# EAGLE schematic actuator_control_1.2.0 (EAGLE 8.1.1)
DESCRIPTION: microOBD 200 OBD-II Module; HW_REV: 1.4; PCB_REV: C; PCB_SPEC1: Layer Count: 4; PCB_SPEC2: Size: 1.3" x 0.59"; PCB_SPEC3: Finish Thickness: 0.049" - 0.052"; PCB_SPEC4: Copper Weight: 1oz; TITLE: STM1120

## Sheet 1 of 6: Solenoid Bank 1
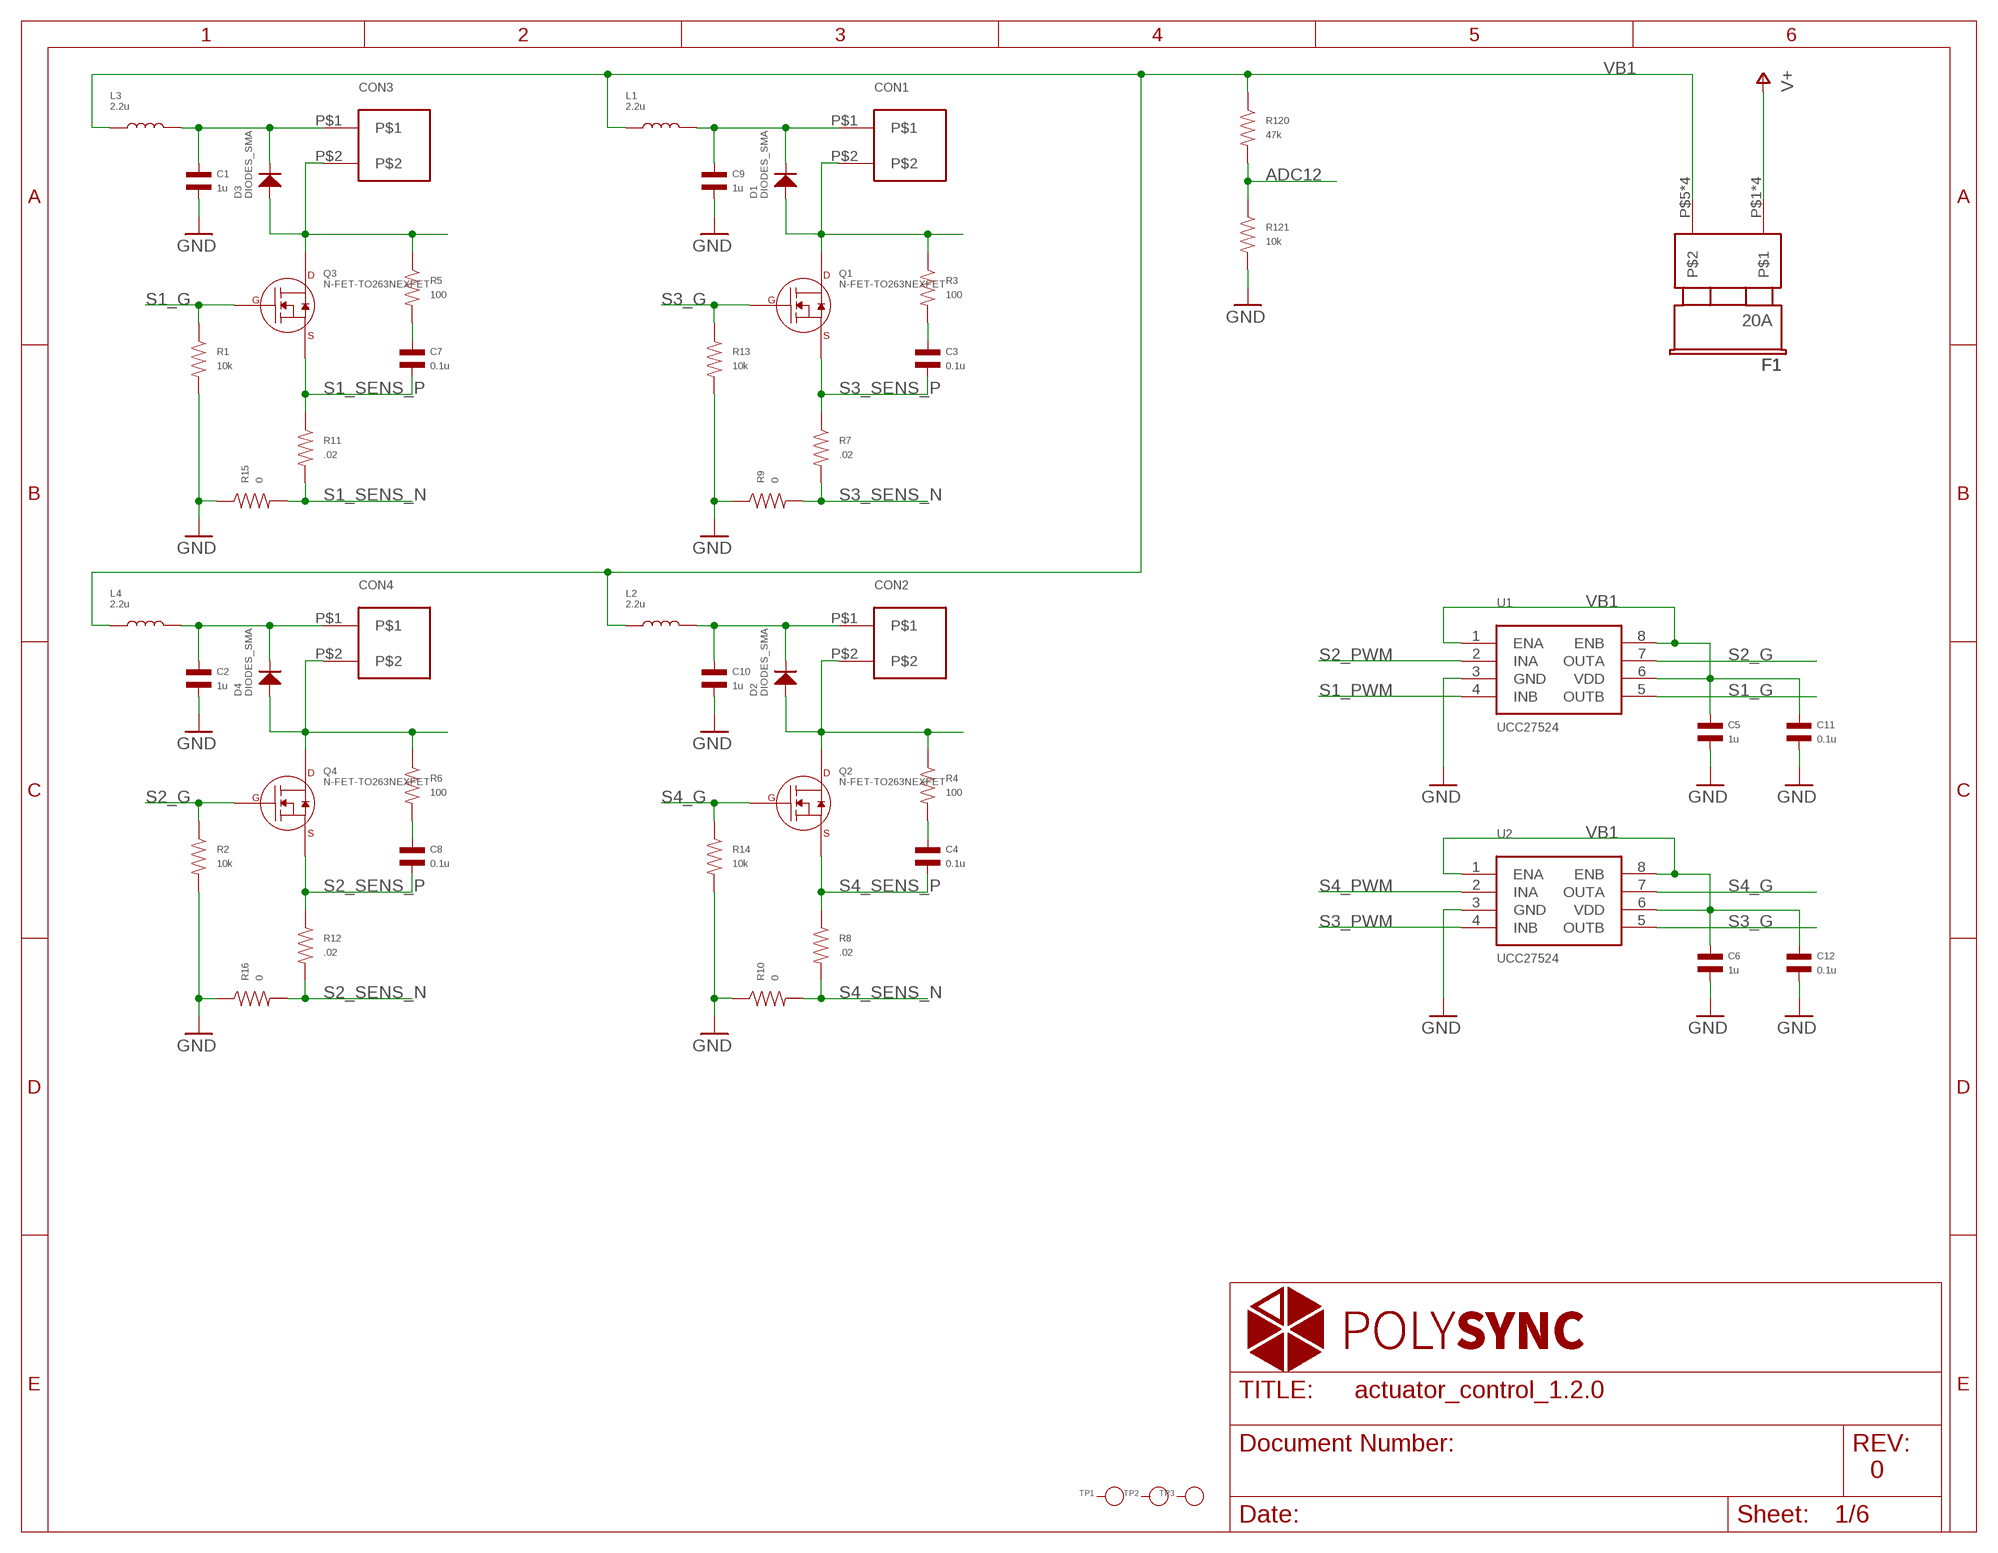
[diagram p0: schematic, sheet 1]

### Parts
C1  1u  CAPACITOR_NP_1206  [C1206]
C2  1u  CAPACITOR_NP_1206  [C1206]
C3  0.1u  CAPACITOR_NP_0805  [C0805]
C4  0.1u  CAPACITOR_NP_0805  [C0805]
C5  1u  CAPACITOR_NP_1206  [C1206]
C6  1u  CAPACITOR_NP_1206  [C1206]
C7  0.1u  CAPACITOR_NP_0805  [C0805]
C8  0.1u  CAPACITOR_NP_0805  [C0805]
C9  1u  CAPACITOR_NP_1206  [C1206]
C10  1u  CAPACITOR_NP_1206  [C1206]
C11  0.1u  CAPACITOR_NP_0805  [C0805]
C12  0.1u  CAPACITOR_NP_0805  [C0805]
CON1  CON23.5MM  [PHOENIX_2_45]
CON2  CON23.5MM  [PHOENIX_2_45]
CON3  CON23.5MM  [PHOENIX_2_45]
CON4  CON23.5MM  [PHOENIX_2_45]
D1  DIODES_SMA  [SMA]
D2  DIODES_SMA  [SMA]
D3  DIODES_SMA  [SMA]
D4  DIODES_SMA  [SMA]
F1  20A  FUSE  [FUSE_ATO]
L1  2.2u  INDUCTORSRP7050  [SRP7050]
L2  2.2u  INDUCTORSRP7050  [SRP7050]
L3  2.2u  INDUCTORSRP7050  [SRP7050]
L4  2.2u  INDUCTORSRP7050  [SRP7050]
Q1  N-FET-TO263NEXFET  [SON8-DQJ]
Q2  N-FET-TO263NEXFET  [SON8-DQJ]
Q3  N-FET-TO263NEXFET  [SON8-DQJ]
Q4  N-FET-TO263NEXFET  [SON8-DQJ]
R1  10k  RESISTOR_0402  [R0402]
R2  10k  RESISTOR_0402  [R0402]
R3  100  RESISTOR_0805  [R0805]
R4  100  RESISTOR_0805  [R0805]
R5  100  RESISTOR_0805  [R0805]
R6  100  RESISTOR_0805  [R0805]
R7  .02  RESISTOR_1206  [R1206]
R8  .02  RESISTOR_1206  [R1206]
R9  0  RESISTOR_0805  [R0805]
R10  0  RESISTOR_0805  [R0805]
R11  .02  RESISTOR_1206  [R1206]
R12  .02  RESISTOR_1206  [R1206]
R13  10k  RESISTOR_0402  [R0402]
R14  10k  RESISTOR_0402  [R0402]
R15  0  RESISTOR_0805  [R0805]
R16  0  RESISTOR_0805  [R0805]
R120  47k  RESISTOR_0402  [R0402]
R121  10k  RESISTOR_0402  [R0402]
TP1  PAD-TEST-POINT'4545'  [TP_4545]
TP2  PAD-TEST-POINT'4545'  [TP_4545]
TP3  PAD-TEST-POINT'4545'  [TP_4545]
U1  UCC27524  [SOIC-8]
U2  UCC27524  [SOIC-8]

### Nets
ADC12: R120.P$2 R121.P$1 ; also sheet 5
GND: C1.P$2 C2.P$2 C5.P$2 C6.P$2 C9.P$2 C10.P$2 C11.P$2 C12.P$2 R1.P$2 R2.P$2 R9.P$1 R10.P$1 R13.P$2 R14.P$2 R15.P$1 R16.P$1 R121.P$2 U1.3(GND) U2.3(GND) ; also sheet 2,3,4,5,6
N$1: C1.P$1 CON3.P$1 D3.CATHODE L3.P$2
N$5: CON3.P$2 D3.ANODE Q3.P$5(DRAIN) Q3.P$6(DRAIN) Q3.P$7(DRAIN) Q3.P$8(DRAIN) Q3.P$9(DRAIN) R5.P$1
N$6: C7.P$1 R5.P$2
N$9: C2.P$1 CON4.P$1 D4.CATHODE L4.P$2
N$10: CON4.P$2 D4.ANODE Q4.P$5(DRAIN) Q4.P$6(DRAIN) Q4.P$7(DRAIN) Q4.P$8(DRAIN) Q4.P$9(DRAIN) R6.P$1
N$11: C8.P$1 R6.P$2
N$13: C9.P$1 CON1.P$1 D1.CATHODE L1.P$2
N$14: CON1.P$2 D1.ANODE Q1.P$5(DRAIN) Q1.P$6(DRAIN) Q1.P$7(DRAIN) Q1.P$8(DRAIN) Q1.P$9(DRAIN) R3.P$1
N$15: C3.P$1 R3.P$2
N$17: C10.P$1 CON2.P$1 D2.CATHODE L2.P$2
N$18: CON2.P$2 D2.ANODE Q2.P$5(DRAIN) Q2.P$6(DRAIN) Q2.P$7(DRAIN) Q2.P$8(DRAIN) Q2.P$9(DRAIN) R4.P$1
N$19: C4.P$1 R4.P$2
S1_G: Q3.P$4(GATE) R1.P$1 U1.5(OUTB)
S1_PWM: U1.4(INB) ; also sheet 5
S1_SENS_N: R11.P$2 R15.P$2 ; also sheet 3
S1_SENS_P: C7.P$2 Q3.P$1(SOURCE) Q3.P$2(SOURCE) Q3.P$3(SOURCE) R11.P$1 ; also sheet 3
S2_G: Q4.P$4(GATE) R2.P$1 U1.7(OUTA)
S2_PWM: U1.2(INA) ; also sheet 5
S2_SENS_N: R12.P$2 R16.P$2 ; also sheet 3
S2_SENS_P: C8.P$2 Q4.P$1(SOURCE) Q4.P$2(SOURCE) Q4.P$3(SOURCE) R12.P$1 ; also sheet 3
S3_G: Q1.P$4(GATE) R13.P$1 U2.5(OUTB)
S3_PWM: U2.4(INB) ; also sheet 5
S3_SENS_N: R7.P$2 R9.P$2 ; also sheet 3
S3_SENS_P: C3.P$2 Q1.P$1(SOURCE) Q1.P$2(SOURCE) Q1.P$3(SOURCE) R7.P$1 ; also sheet 3
S4_G: Q2.P$4(GATE) R14.P$1 U2.7(OUTA)
S4_PWM: U2.2(INA) ; also sheet 5
S4_SENS_N: R8.P$2 R10.P$2 ; also sheet 3
S4_SENS_P: C4.P$2 Q2.P$1(SOURCE) Q2.P$2(SOURCE) Q2.P$3(SOURCE) R8.P$1 ; also sheet 3
V+: F1.P$1 F1.P$2 F1.P$3 F1.P$4 ; also sheet 5,6
VB1: C5.P$1 C6.P$1 C11.P$1 C12.P$1 F1.P$5 F1.P$6 F1.P$7 F1.P$8 L1.P$1 L2.P$1 L3.P$1 L4.P$1 R120.P$1 U1.1(ENA) U1.6(VDD) U1.8(ENB) U2.1(ENA) U2.6(VDD) U2.8(ENB) ; also sheet 2
Unconnected: TP1.T TP2.T TP3.T

### Notes on the sheet
- 0

## Sheet 2 of 6: Solenoid Bank 2
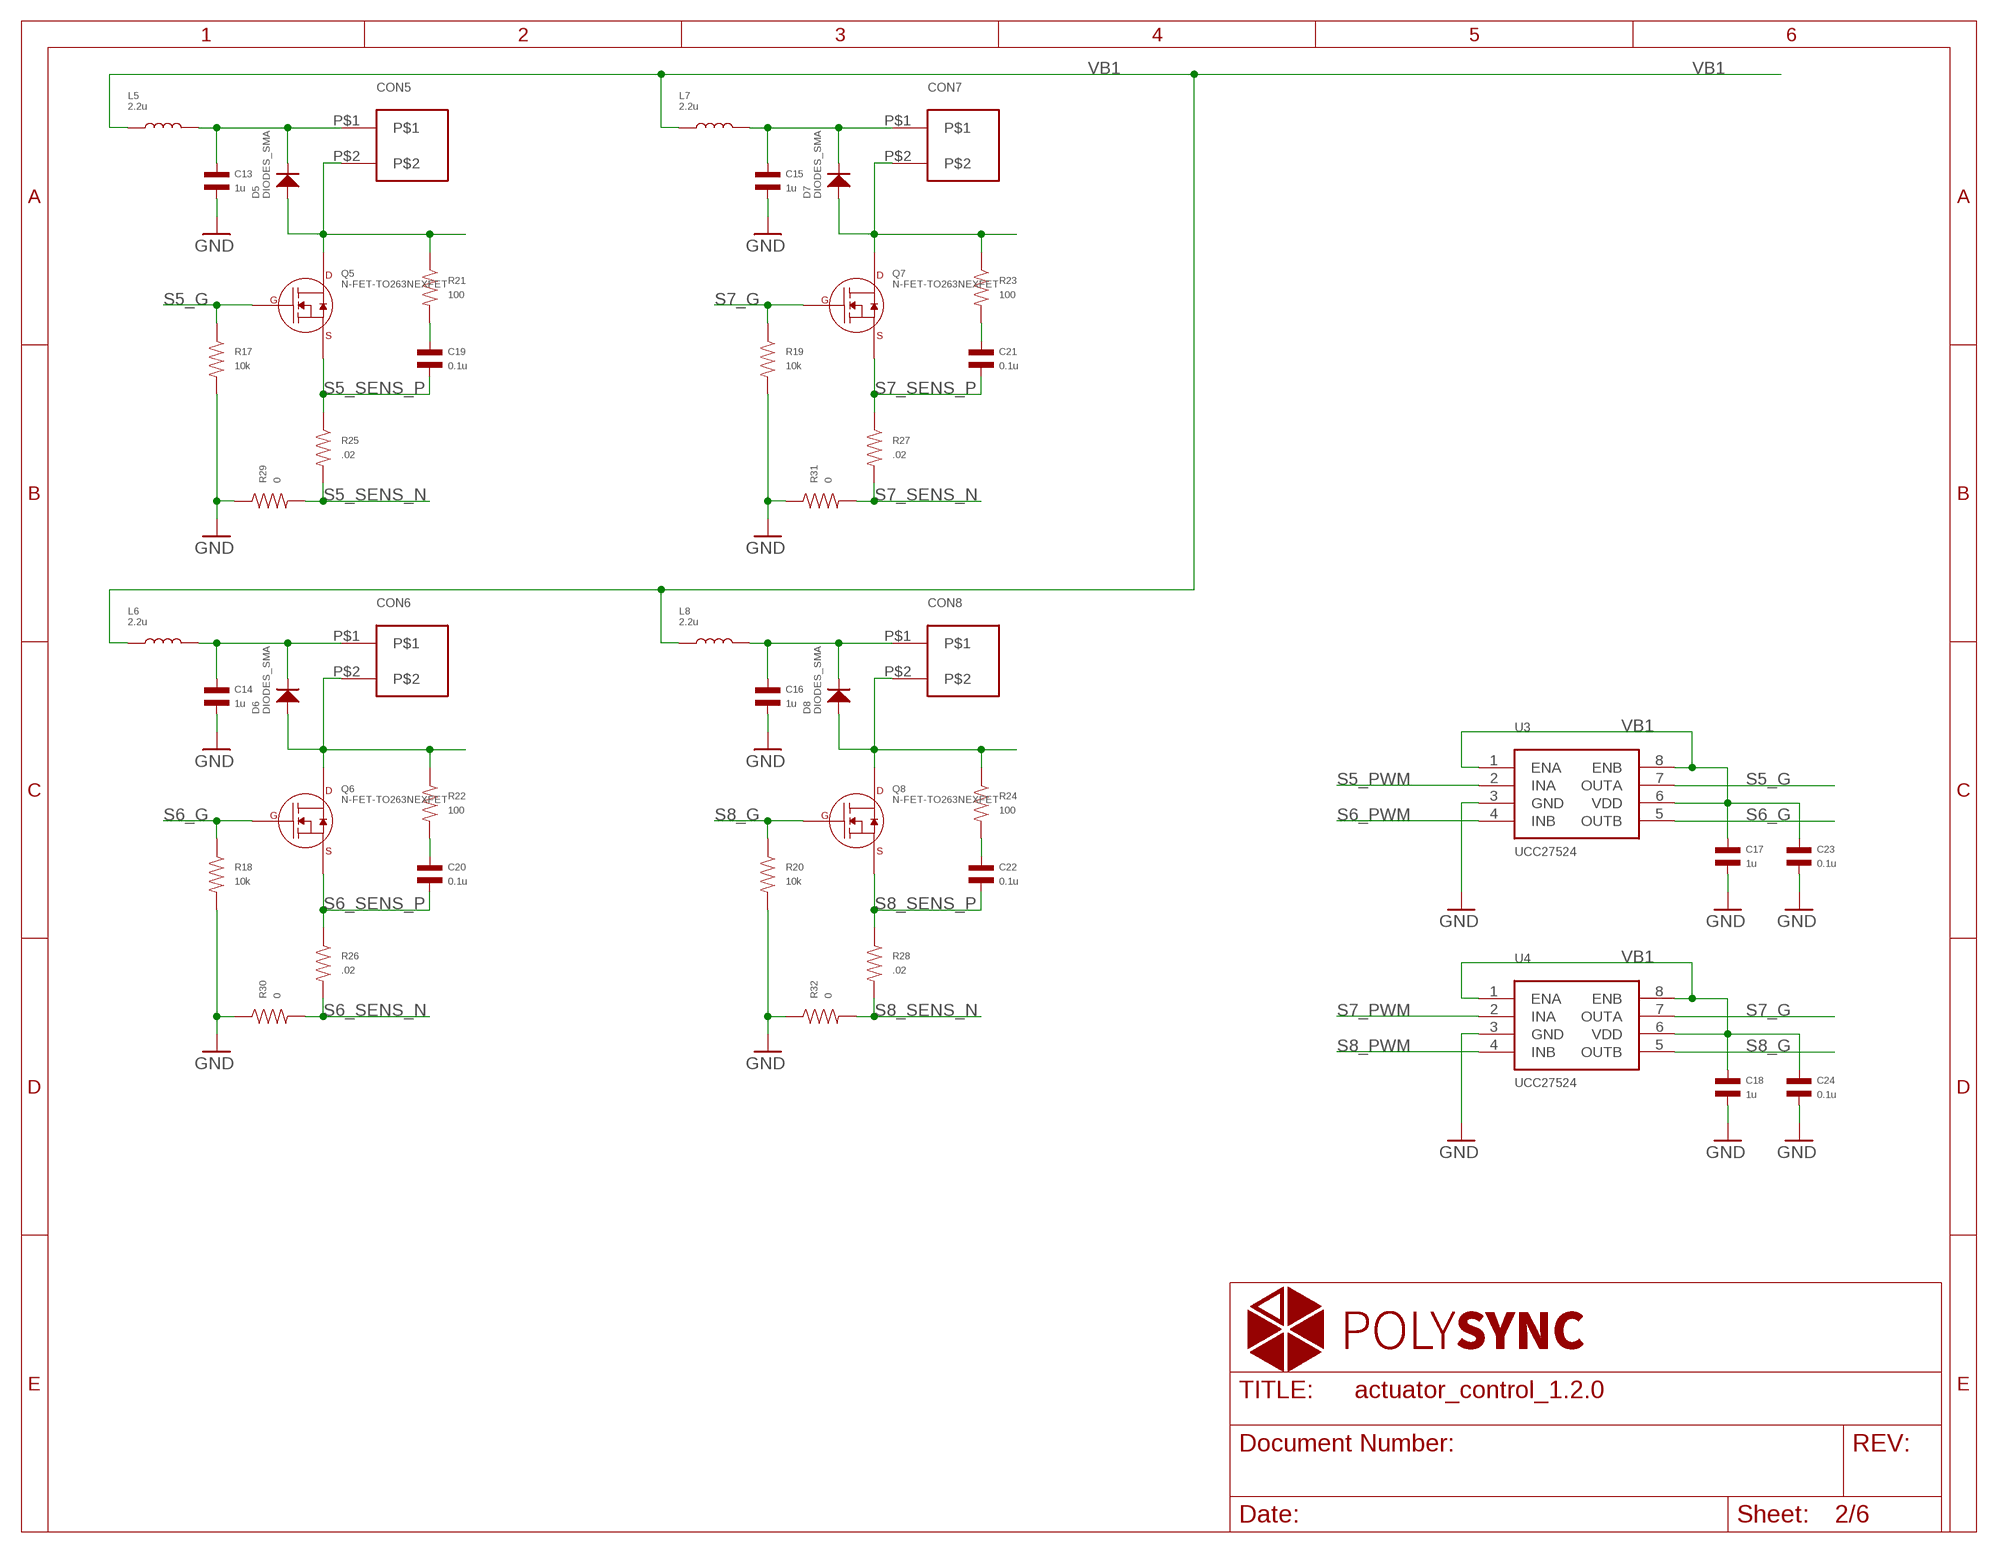
[diagram p1: schematic, sheet 2]

### Parts
C13  1u  CAPACITOR_NP_1206  [C1206]
C14  1u  CAPACITOR_NP_1206  [C1206]
C15  1u  CAPACITOR_NP_1206  [C1206]
C16  1u  CAPACITOR_NP_1206  [C1206]
C17  1u  CAPACITOR_NP_1206  [C1206]
C18  1u  CAPACITOR_NP_1206  [C1206]
C19  0.1u  CAPACITOR_NP_0805  [C0805]
C20  0.1u  CAPACITOR_NP_0805  [C0805]
C21  0.1u  CAPACITOR_NP_0805  [C0805]
C22  0.1u  CAPACITOR_NP_0805  [C0805]
C23  0.1u  CAPACITOR_NP_0805  [C0805]
C24  0.1u  CAPACITOR_NP_0805  [C0805]
CON5  CON23.5MM  [PHOENIX_2_45]
CON6  CON23.5MM  [PHOENIX_2_45]
CON7  CON23.5MM  [PHOENIX_2_45]
CON8  CON23.5MM  [PHOENIX_2_45]
D5  DIODES_SMA  [SMA]
D6  DIODES_SMA  [SMA]
D7  DIODES_SMA  [SMA]
D8  DIODES_SMA  [SMA]
L5  2.2u  INDUCTORSRP7050  [SRP7050]
L6  2.2u  INDUCTORSRP7050  [SRP7050]
L7  2.2u  INDUCTORSRP7050  [SRP7050]
L8  2.2u  INDUCTORSRP7050  [SRP7050]
Q5  N-FET-TO263NEXFET  [SON8-DQJ]
Q6  N-FET-TO263NEXFET  [SON8-DQJ]
Q7  N-FET-TO263NEXFET  [SON8-DQJ]
Q8  N-FET-TO263NEXFET  [SON8-DQJ]
R17  10k  RESISTOR_0402  [R0402]
R18  10k  RESISTOR_0402  [R0402]
R19  10k  RESISTOR_0402  [R0402]
R20  10k  RESISTOR_0402  [R0402]
R21  100  RESISTOR_0805  [R0805]
R22  100  RESISTOR_0805  [R0805]
R23  100  RESISTOR_0805  [R0805]
R24  100  RESISTOR_0805  [R0805]
R25  .02  RESISTOR_1206  [R1206]
R26  .02  RESISTOR_1206  [R1206]
R27  .02  RESISTOR_1206  [R1206]
R28  .02  RESISTOR_1206  [R1206]
R29  0  RESISTOR_0805  [R0805]
R30  0  RESISTOR_0805  [R0805]
R31  0  RESISTOR_0805  [R0805]
R32  0  RESISTOR_0805  [R0805]
U3  UCC27524  [SOIC-8]
U4  UCC27524  [SOIC-8]

### Nets
GND: C13.P$2 C14.P$2 C15.P$2 C16.P$2 C17.P$2 C18.P$2 C23.P$2 C24.P$2 R17.P$2 R18.P$2 R19.P$2 R20.P$2 R29.P$1 R30.P$1 R31.P$1 R32.P$1 U3.3(GND) U4.3(GND) ; also sheet 1,3,4,5,6
N$3: C13.P$1 CON5.P$1 D5.CATHODE L5.P$2
N$8: CON5.P$2 D5.ANODE Q5.P$5(DRAIN) Q5.P$6(DRAIN) Q5.P$7(DRAIN) Q5.P$8(DRAIN) Q5.P$9(DRAIN) R21.P$1
N$32: C19.P$1 R21.P$2
N$36: C14.P$1 CON6.P$1 D6.CATHODE L6.P$2
N$37: CON6.P$2 D6.ANODE Q6.P$5(DRAIN) Q6.P$6(DRAIN) Q6.P$7(DRAIN) Q6.P$8(DRAIN) Q6.P$9(DRAIN) R22.P$1
N$38: C20.P$1 R22.P$2
N$40: C15.P$1 CON7.P$1 D7.CATHODE L7.P$2
N$41: CON7.P$2 D7.ANODE Q7.P$5(DRAIN) Q7.P$6(DRAIN) Q7.P$7(DRAIN) Q7.P$8(DRAIN) Q7.P$9(DRAIN) R23.P$1
N$42: C21.P$1 R23.P$2
N$44: C16.P$1 CON8.P$1 D8.CATHODE L8.P$2
N$45: CON8.P$2 D8.ANODE Q8.P$5(DRAIN) Q8.P$6(DRAIN) Q8.P$7(DRAIN) Q8.P$8(DRAIN) Q8.P$9(DRAIN) R24.P$1
N$46: C22.P$1 R24.P$2
S5_G: Q5.P$4(GATE) R17.P$1 U3.7(OUTA)
S5_PWM: U3.2(INA) ; also sheet 5
S5_SENS_N: R25.P$2 R29.P$2 ; also sheet 4
S5_SENS_P: C19.P$2 Q5.P$1(SOURCE) Q5.P$2(SOURCE) Q5.P$3(SOURCE) R25.P$1 ; also sheet 4
S6_G: Q6.P$4(GATE) R18.P$1 U3.5(OUTB)
S6_PWM: U3.4(INB) ; also sheet 5
S6_SENS_N: R26.P$2 R30.P$2 ; also sheet 4
S6_SENS_P: C20.P$2 Q6.P$1(SOURCE) Q6.P$2(SOURCE) Q6.P$3(SOURCE) R26.P$1 ; also sheet 4
S7_G: Q7.P$4(GATE) R19.P$1 U4.7(OUTA)
S7_PWM: U4.2(INA) ; also sheet 5
S7_SENS_N: R27.P$2 R31.P$2 ; also sheet 4
S7_SENS_P: C21.P$2 Q7.P$1(SOURCE) Q7.P$2(SOURCE) Q7.P$3(SOURCE) R27.P$1 ; also sheet 4
S8_G: Q8.P$4(GATE) R20.P$1 U4.5(OUTB)
S8_PWM: U4.4(INB) ; also sheet 5
S8_SENS_N: R28.P$2 R32.P$2 ; also sheet 4
S8_SENS_P: C22.P$2 Q8.P$1(SOURCE) Q8.P$2(SOURCE) Q8.P$3(SOURCE) R28.P$1 ; also sheet 4
VB1: C17.P$1 C18.P$1 C23.P$1 C24.P$1 L5.P$1 L6.P$1 L7.P$1 L8.P$1 U3.1(ENA) U3.6(VDD) U3.8(ENB) U4.1(ENA) U4.6(VDD) U4.8(ENB) ; also sheet 1

## Sheet 3 of 6: Current Sense Bank 1
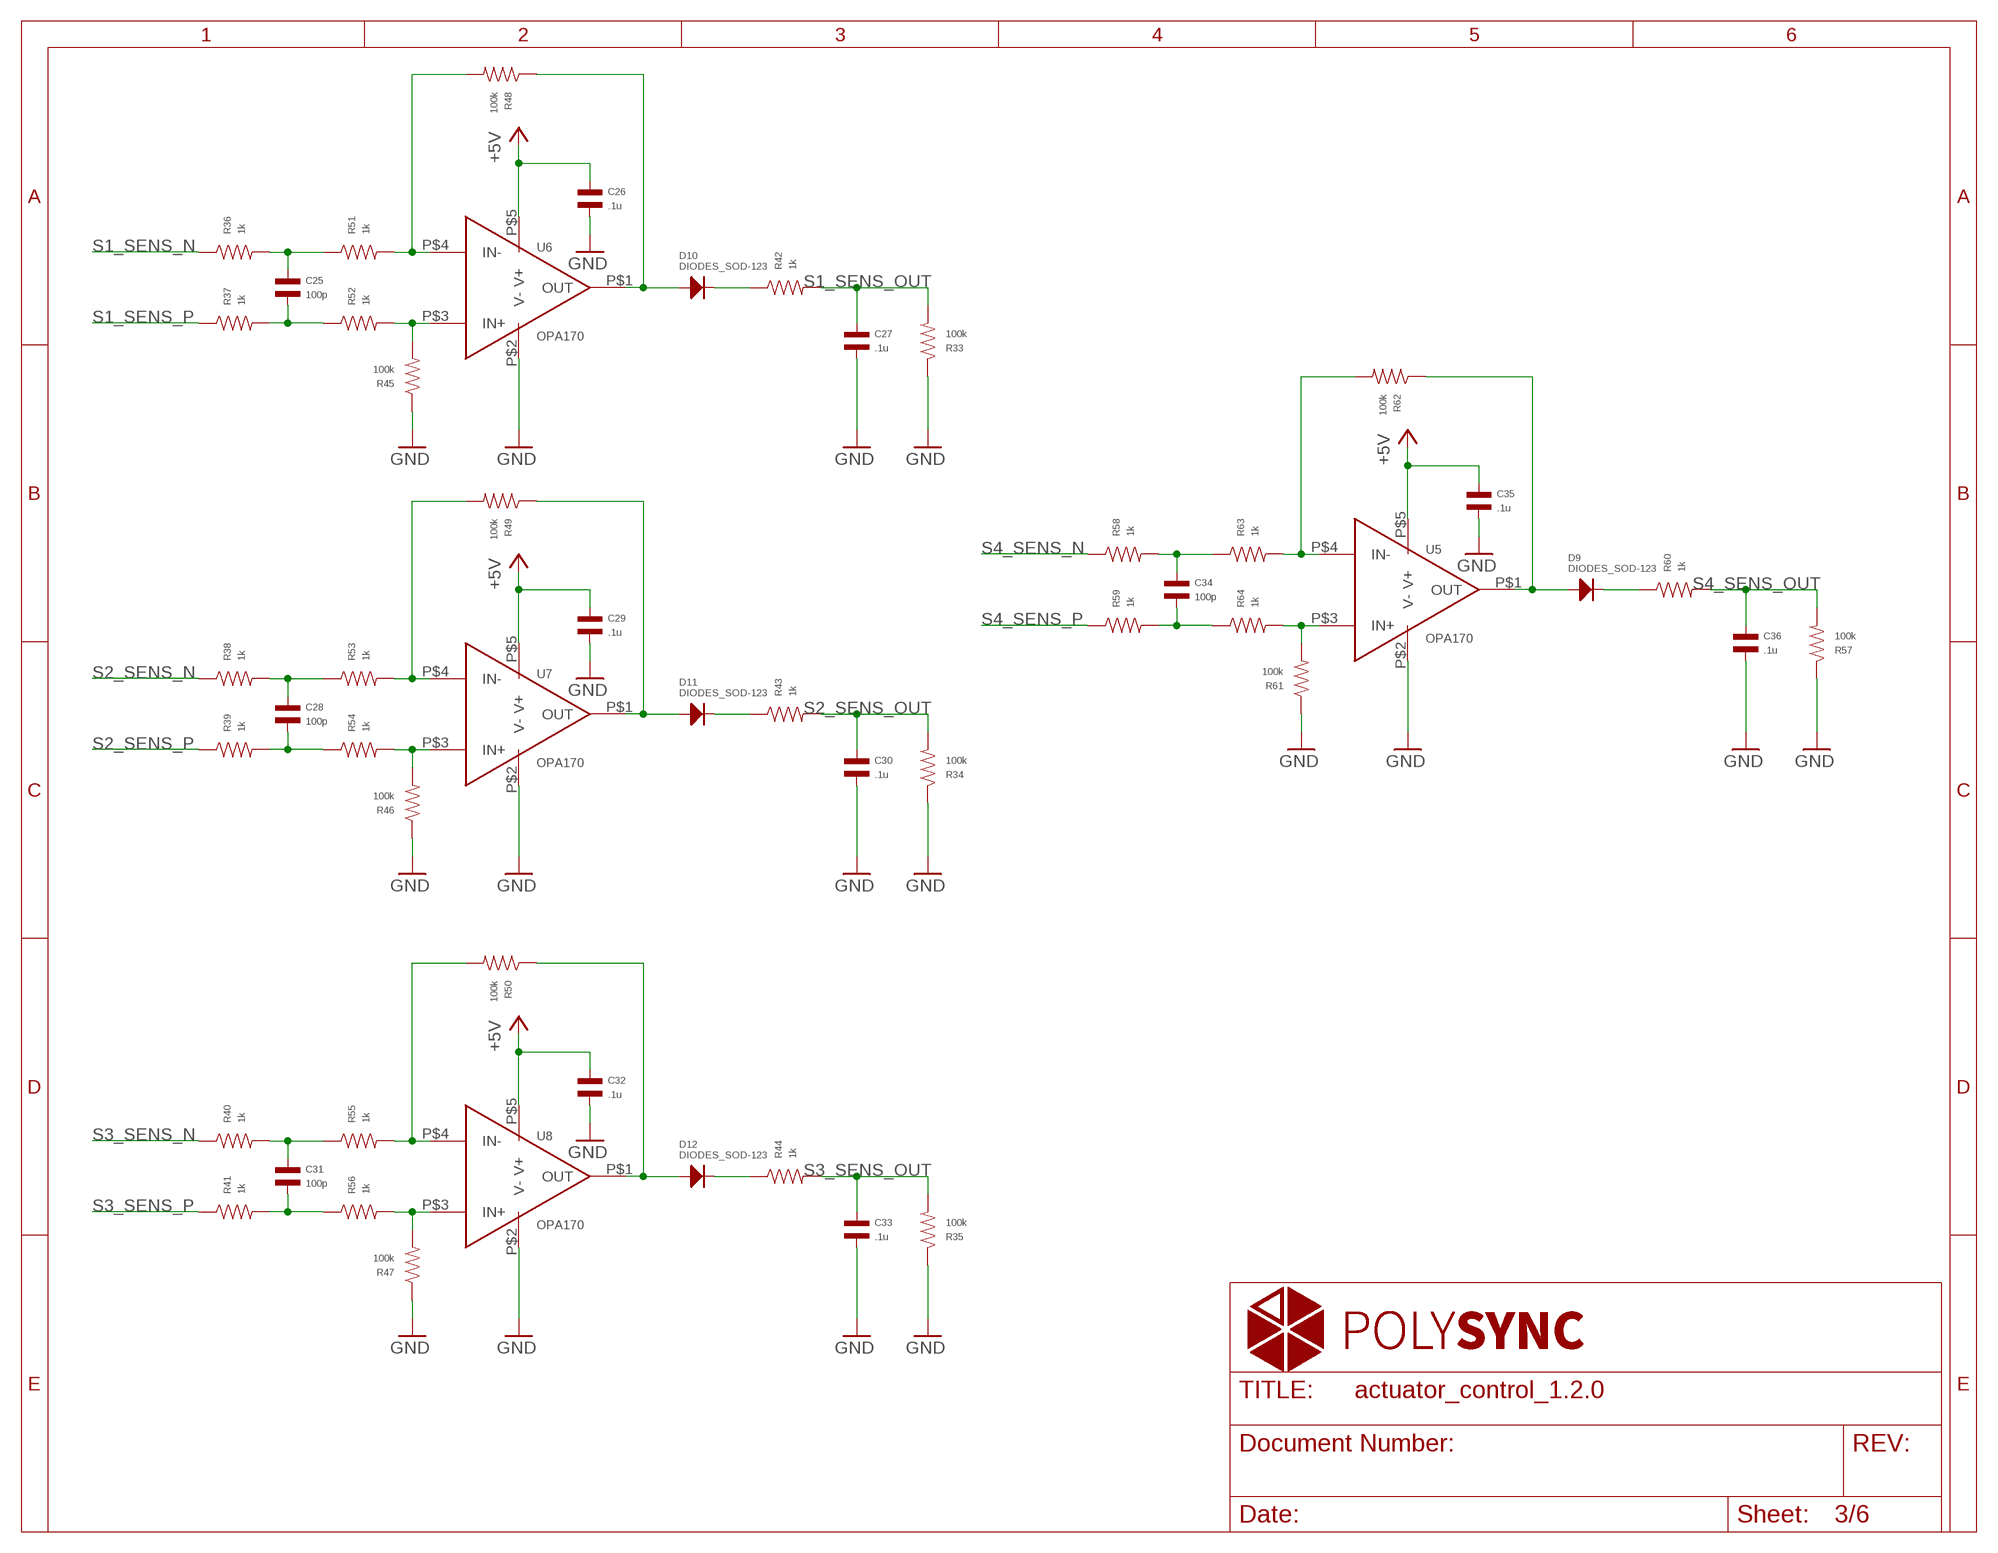
[diagram p2: schematic, sheet 3]

### Parts
C25  100p  CAPACITOR_NP_0402  [C0402]
C26  .1u  CAPACITOR_NP_0402  [C0402]
C27  .1u  CAPACITOR_NP_0402  [C0402]
C28  100p  CAPACITOR_NP_0402  [C0402]
C29  .1u  CAPACITOR_NP_0402  [C0402]
C30  .1u  CAPACITOR_NP_0402  [C0402]
C31  100p  CAPACITOR_NP_0402  [C0402]
C32  .1u  CAPACITOR_NP_0402  [C0402]
C33  .1u  CAPACITOR_NP_0402  [C0402]
C34  100p  CAPACITOR_NP_0402  [C0402]
C35  .1u  CAPACITOR_NP_0402  [C0402]
C36  .1u  CAPACITOR_NP_0402  [C0402]
D9  DIODES_SOD-123  [SOD-123]
D10  DIODES_SOD-123  [SOD-123]
D11  DIODES_SOD-123  [SOD-123]
D12  DIODES_SOD-123  [SOD-123]
R33  100k  RESISTOR_0402  [R0402]
R34  100k  RESISTOR_0402  [R0402]
R35  100k  RESISTOR_0402  [R0402]
R36  1k  RESISTOR_0402  [R0402]
R37  1k  RESISTOR_0402  [R0402]
R38  1k  RESISTOR_0402  [R0402]
R39  1k  RESISTOR_0402  [R0402]
R40  1k  RESISTOR_0402  [R0402]
R41  1k  RESISTOR_0402  [R0402]
R42  1k  RESISTOR_0402  [R0402]
R43  1k  RESISTOR_0402  [R0402]
R44  1k  RESISTOR_0402  [R0402]
R45  100k  RESISTOR_0402  [R0402]
R46  100k  RESISTOR_0402  [R0402]
R47  100k  RESISTOR_0402  [R0402]
R48  100k  RESISTOR_0402  [R0402]
R49  100k  RESISTOR_0402  [R0402]
R50  100k  RESISTOR_0402  [R0402]
R51  1k  RESISTOR_0402  [R0402]
R52  1k  RESISTOR_0402  [R0402]
R53  1k  RESISTOR_0402  [R0402]
R54  1k  RESISTOR_0402  [R0402]
R55  1k  RESISTOR_0402  [R0402]
R56  1k  RESISTOR_0402  [R0402]
R57  100k  RESISTOR_0402  [R0402]
R58  1k  RESISTOR_0402  [R0402]
R59  1k  RESISTOR_0402  [R0402]
R60  1k  RESISTOR_0402  [R0402]
R61  100k  RESISTOR_0402  [R0402]
R62  100k  RESISTOR_0402  [R0402]
R63  1k  RESISTOR_0402  [R0402]
R64  1k  RESISTOR_0402  [R0402]
U5  OPA170  [SOT-23-5]
U6  OPA170  [SOT-23-5]
U7  OPA170  [SOT-23-5]
U8  OPA170  [SOT-23-5]

### Nets
+5V: C26.P$1 C29.P$1 C32.P$1 C35.P$1 U5.P$5(V+) U6.P$5(V+) U7.P$5(V+) U8.P$5(V+) ; also sheet 4,5
GND: C26.P$2 C27.P$2 C29.P$2 C30.P$2 C32.P$2 C33.P$2 C35.P$2 C36.P$2 R33.P$1 R34.P$1 R35.P$1 R45.P$1 R46.P$1 R47.P$1 R57.P$1 R61.P$1 U5.P$2(V-) U6.P$2(V-) U7.P$2(V-) U8.P$2(V-) ; also sheet 1,2,4,5,6
N$7: R48.P$2 R51.P$2 U6.P$4(IN-)
N$12: R45.P$2 R52.P$2 U6.P$3(IN+)
N$16: C25.P$2 R37.P$2 R52.P$1
N$20: C25.P$1 R36.P$2 R51.P$1
N$48: D10.ANODE R48.P$1 U6.P$1(OUT)
N$53: D10.CATHODE R42.P$1
N$54: R49.P$2 R53.P$2 U7.P$4(IN-)
N$56: R46.P$2 R54.P$2 U7.P$3(IN+)
N$57: C28.P$2 R39.P$2 R54.P$1
N$58: C28.P$1 R38.P$2 R53.P$1
N$59: D11.ANODE R49.P$1 U7.P$1(OUT)
N$60: D11.CATHODE R43.P$1
N$61: R50.P$2 R55.P$2 U8.P$4(IN-)
N$62: R47.P$2 R56.P$2 U8.P$3(IN+)
N$63: C31.P$2 R41.P$2 R56.P$1
N$64: C31.P$1 R40.P$2 R55.P$1
N$65: D12.ANODE R50.P$1 U8.P$1(OUT)
N$66: D12.CATHODE R44.P$1
N$67: R62.P$2 R63.P$2 U5.P$4(IN-)
N$68: R61.P$2 R64.P$2 U5.P$3(IN+)
N$69: C34.P$2 R59.P$2 R64.P$1
N$70: C34.P$1 R58.P$2 R63.P$1
N$71: D9.ANODE R62.P$1 U5.P$1(OUT)
N$72: D9.CATHODE R60.P$1
S1_SENS_N: R36.P$1 ; also sheet 1
S1_SENS_OUT: C27.P$1 R33.P$2 R42.P$2 ; also sheet 5
S1_SENS_P: R37.P$1 ; also sheet 1
S2_SENS_N: R38.P$1 ; also sheet 1
S2_SENS_OUT: C30.P$1 R34.P$2 R43.P$2 ; also sheet 5
S2_SENS_P: R39.P$1 ; also sheet 1
S3_SENS_N: R40.P$1 ; also sheet 1
S3_SENS_OUT: C33.P$1 R35.P$2 R44.P$2 ; also sheet 5
S3_SENS_P: R41.P$1 ; also sheet 1
S4_SENS_N: R58.P$1 ; also sheet 1
S4_SENS_OUT: C36.P$1 R57.P$2 R60.P$2 ; also sheet 5
S4_SENS_P: R59.P$1 ; also sheet 1

## Sheet 4 of 6: Current Sense Bank 2
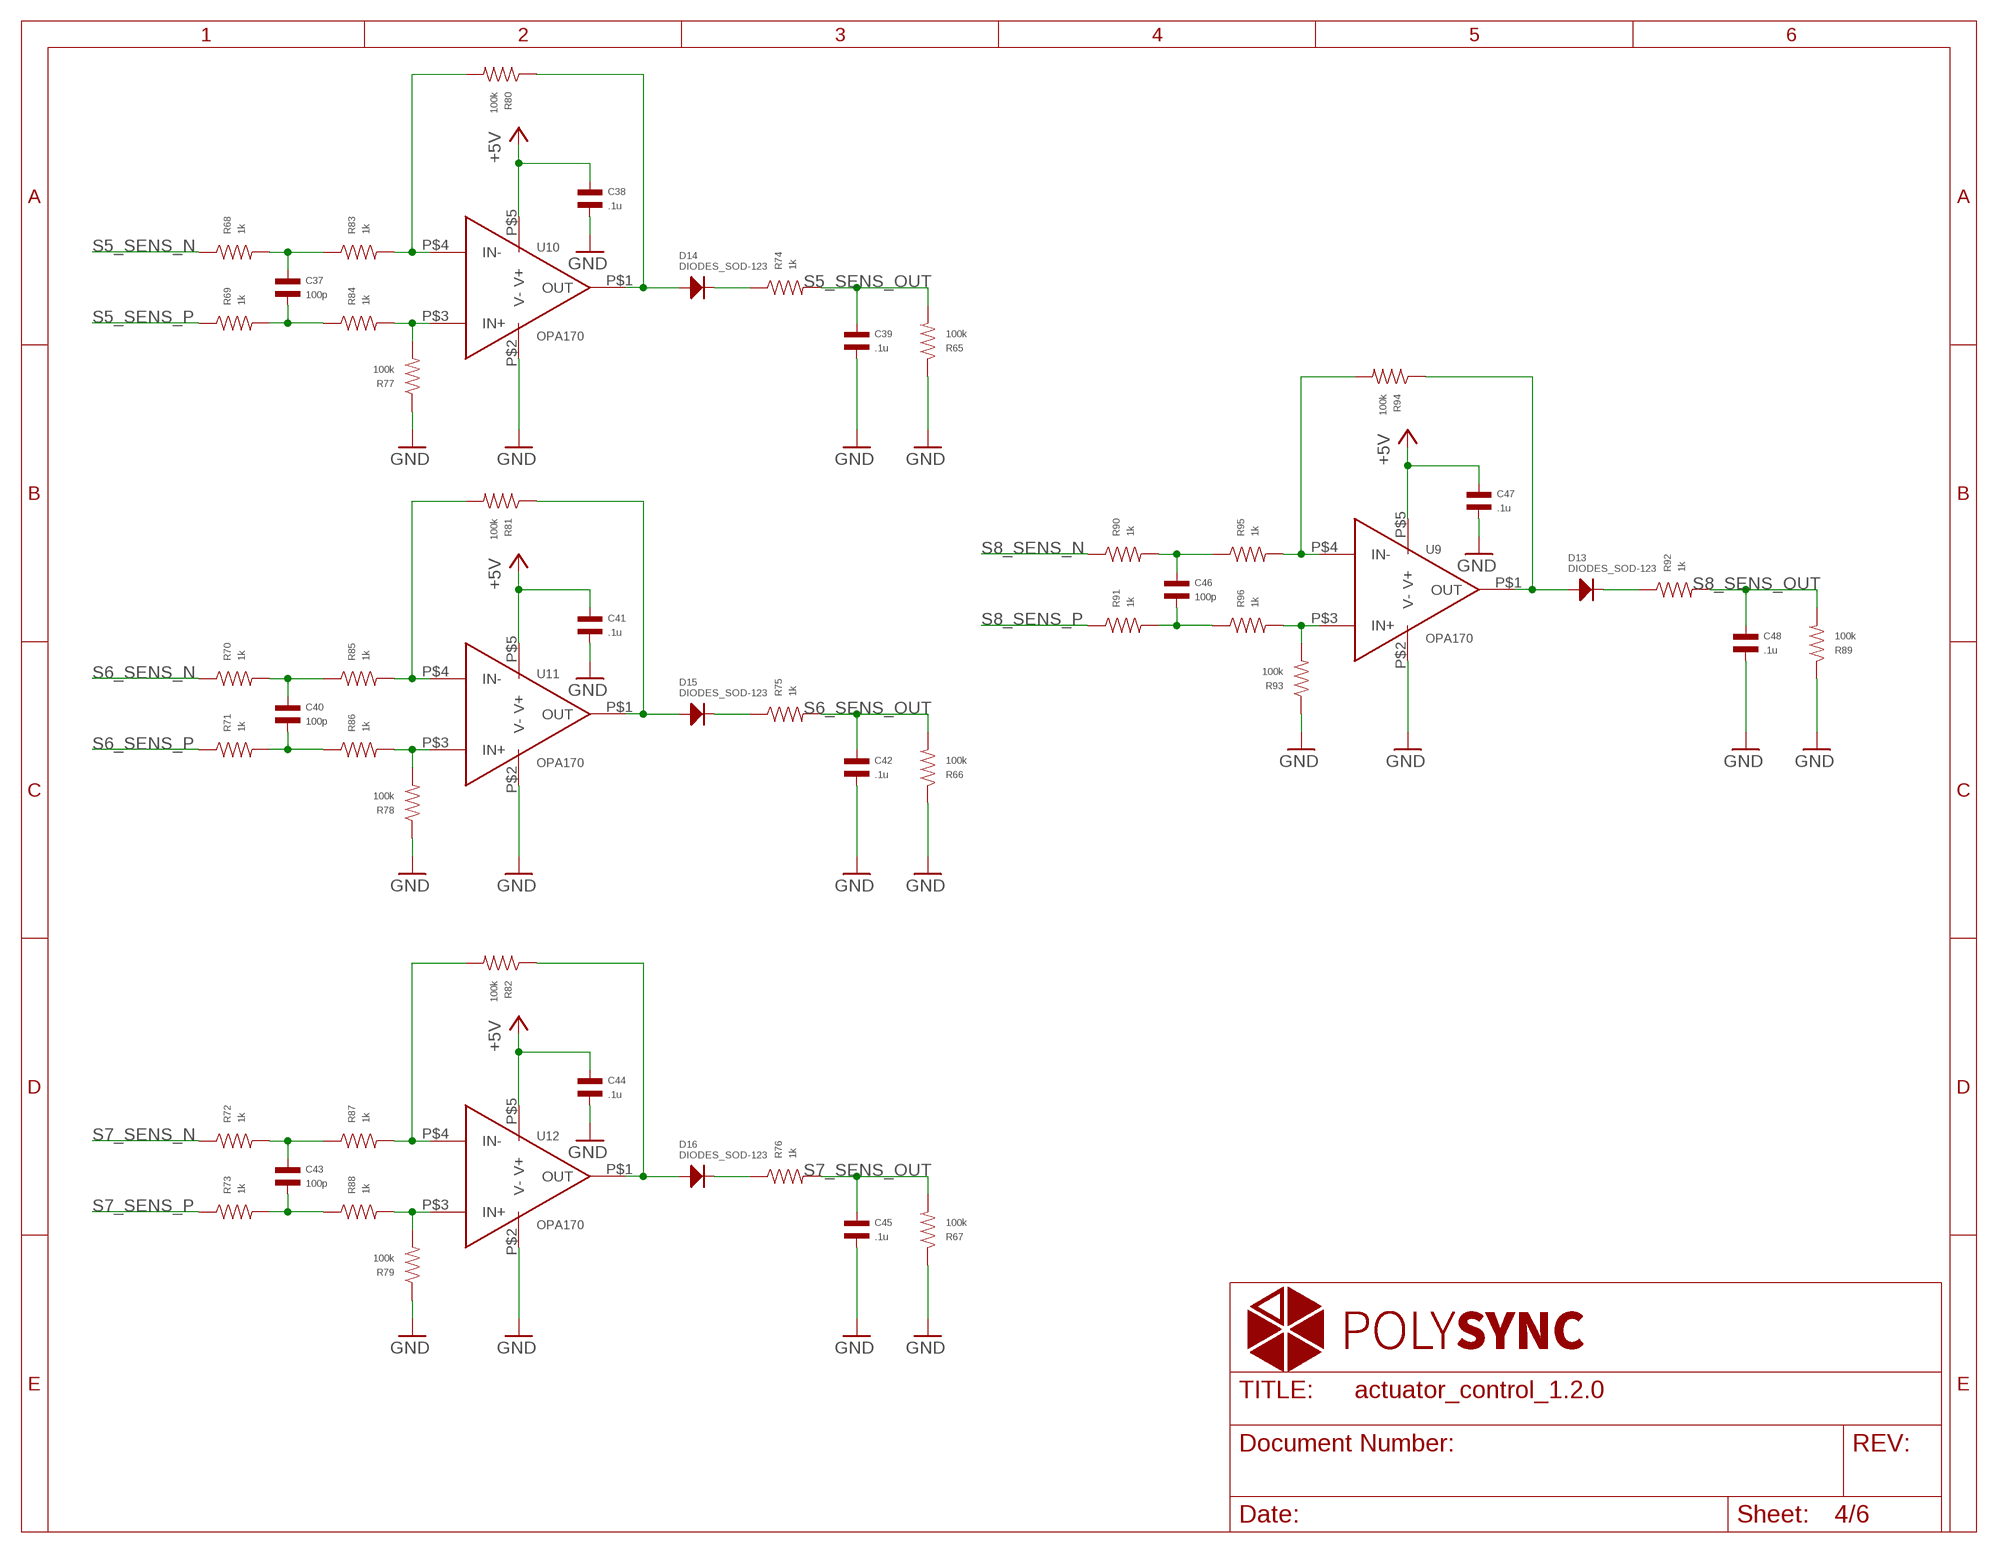
[diagram p3: schematic, sheet 4]

### Parts
C37  100p  CAPACITOR_NP_0402  [C0402]
C38  .1u  CAPACITOR_NP_0402  [C0402]
C39  .1u  CAPACITOR_NP_0402  [C0402]
C40  100p  CAPACITOR_NP_0402  [C0402]
C41  .1u  CAPACITOR_NP_0402  [C0402]
C42  .1u  CAPACITOR_NP_0402  [C0402]
C43  100p  CAPACITOR_NP_0402  [C0402]
C44  .1u  CAPACITOR_NP_0402  [C0402]
C45  .1u  CAPACITOR_NP_0402  [C0402]
C46  100p  CAPACITOR_NP_0402  [C0402]
C47  .1u  CAPACITOR_NP_0402  [C0402]
C48  .1u  CAPACITOR_NP_0402  [C0402]
D13  DIODES_SOD-123  [SOD-123]
D14  DIODES_SOD-123  [SOD-123]
D15  DIODES_SOD-123  [SOD-123]
D16  DIODES_SOD-123  [SOD-123]
R65  100k  RESISTOR_0402  [R0402]
R66  100k  RESISTOR_0402  [R0402]
R67  100k  RESISTOR_0402  [R0402]
R68  1k  RESISTOR_0402  [R0402]
R69  1k  RESISTOR_0402  [R0402]
R70  1k  RESISTOR_0402  [R0402]
R71  1k  RESISTOR_0402  [R0402]
R72  1k  RESISTOR_0402  [R0402]
R73  1k  RESISTOR_0402  [R0402]
R74  1k  RESISTOR_0402  [R0402]
R75  1k  RESISTOR_0402  [R0402]
R76  1k  RESISTOR_0402  [R0402]
R77  100k  RESISTOR_0402  [R0402]
R78  100k  RESISTOR_0402  [R0402]
R79  100k  RESISTOR_0402  [R0402]
R80  100k  RESISTOR_0402  [R0402]
R81  100k  RESISTOR_0402  [R0402]
R82  100k  RESISTOR_0402  [R0402]
R83  1k  RESISTOR_0402  [R0402]
R84  1k  RESISTOR_0402  [R0402]
R85  1k  RESISTOR_0402  [R0402]
R86  1k  RESISTOR_0402  [R0402]
R87  1k  RESISTOR_0402  [R0402]
R88  1k  RESISTOR_0402  [R0402]
R89  100k  RESISTOR_0402  [R0402]
R90  1k  RESISTOR_0402  [R0402]
R91  1k  RESISTOR_0402  [R0402]
R92  1k  RESISTOR_0402  [R0402]
R93  100k  RESISTOR_0402  [R0402]
R94  100k  RESISTOR_0402  [R0402]
R95  1k  RESISTOR_0402  [R0402]
R96  1k  RESISTOR_0402  [R0402]
U9  OPA170  [SOT-23-5]
U10  OPA170  [SOT-23-5]
U11  OPA170  [SOT-23-5]
U12  OPA170  [SOT-23-5]

### Nets
+5V: C38.P$1 C41.P$1 C44.P$1 C47.P$1 U9.P$5(V+) U10.P$5(V+) U11.P$5(V+) U12.P$5(V+) ; also sheet 3,5
GND: C38.P$2 C39.P$2 C41.P$2 C42.P$2 C44.P$2 C45.P$2 C47.P$2 C48.P$2 R65.P$1 R66.P$1 R67.P$1 R77.P$1 R78.P$1 R79.P$1 R89.P$1 R93.P$1 U9.P$2(V-) U10.P$2(V-) U11.P$2(V-) U12.P$2(V-) ; also sheet 1,2,3,5,6
N$73: R80.P$2 R83.P$2 U10.P$4(IN-)
N$74: R77.P$2 R84.P$2 U10.P$3(IN+)
N$75: C37.P$2 R69.P$2 R84.P$1
N$76: C37.P$1 R68.P$2 R83.P$1
N$77: D14.ANODE R80.P$1 U10.P$1(OUT)
N$78: D14.CATHODE R74.P$1
N$79: R81.P$2 R85.P$2 U11.P$4(IN-)
N$80: R78.P$2 R86.P$2 U11.P$3(IN+)
N$81: C40.P$2 R71.P$2 R86.P$1
N$82: C40.P$1 R70.P$2 R85.P$1
N$83: D15.ANODE R81.P$1 U11.P$1(OUT)
N$84: D15.CATHODE R75.P$1
N$85: R82.P$2 R87.P$2 U12.P$4(IN-)
N$86: R79.P$2 R88.P$2 U12.P$3(IN+)
N$87: C43.P$2 R73.P$2 R88.P$1
N$88: C43.P$1 R72.P$2 R87.P$1
N$89: D16.ANODE R82.P$1 U12.P$1(OUT)
N$90: D16.CATHODE R76.P$1
N$91: R94.P$2 R95.P$2 U9.P$4(IN-)
N$92: R93.P$2 R96.P$2 U9.P$3(IN+)
N$93: C46.P$2 R91.P$2 R96.P$1
N$94: C46.P$1 R90.P$2 R95.P$1
N$95: D13.ANODE R94.P$1 U9.P$1(OUT)
N$96: D13.CATHODE R92.P$1
S5_SENS_N: R68.P$1 ; also sheet 2
S5_SENS_OUT: C39.P$1 R65.P$2 R74.P$2 ; also sheet 5
S5_SENS_P: R69.P$1 ; also sheet 2
S6_SENS_N: R70.P$1 ; also sheet 2
S6_SENS_OUT: C42.P$1 R66.P$2 R75.P$2 ; also sheet 5
S6_SENS_P: R71.P$1 ; also sheet 2
S7_SENS_N: R72.P$1 ; also sheet 2
S7_SENS_OUT: C45.P$1 R67.P$2 R76.P$2 ; also sheet 5
S7_SENS_P: R73.P$1 ; also sheet 2
S8_SENS_N: R90.P$1 ; also sheet 2
S8_SENS_OUT: C48.P$1 R89.P$2 R92.P$2 ; also sheet 5
S8_SENS_P: R91.P$1 ; also sheet 2

## Sheet 5 of 6: Connectors, CAN, Pump Relay
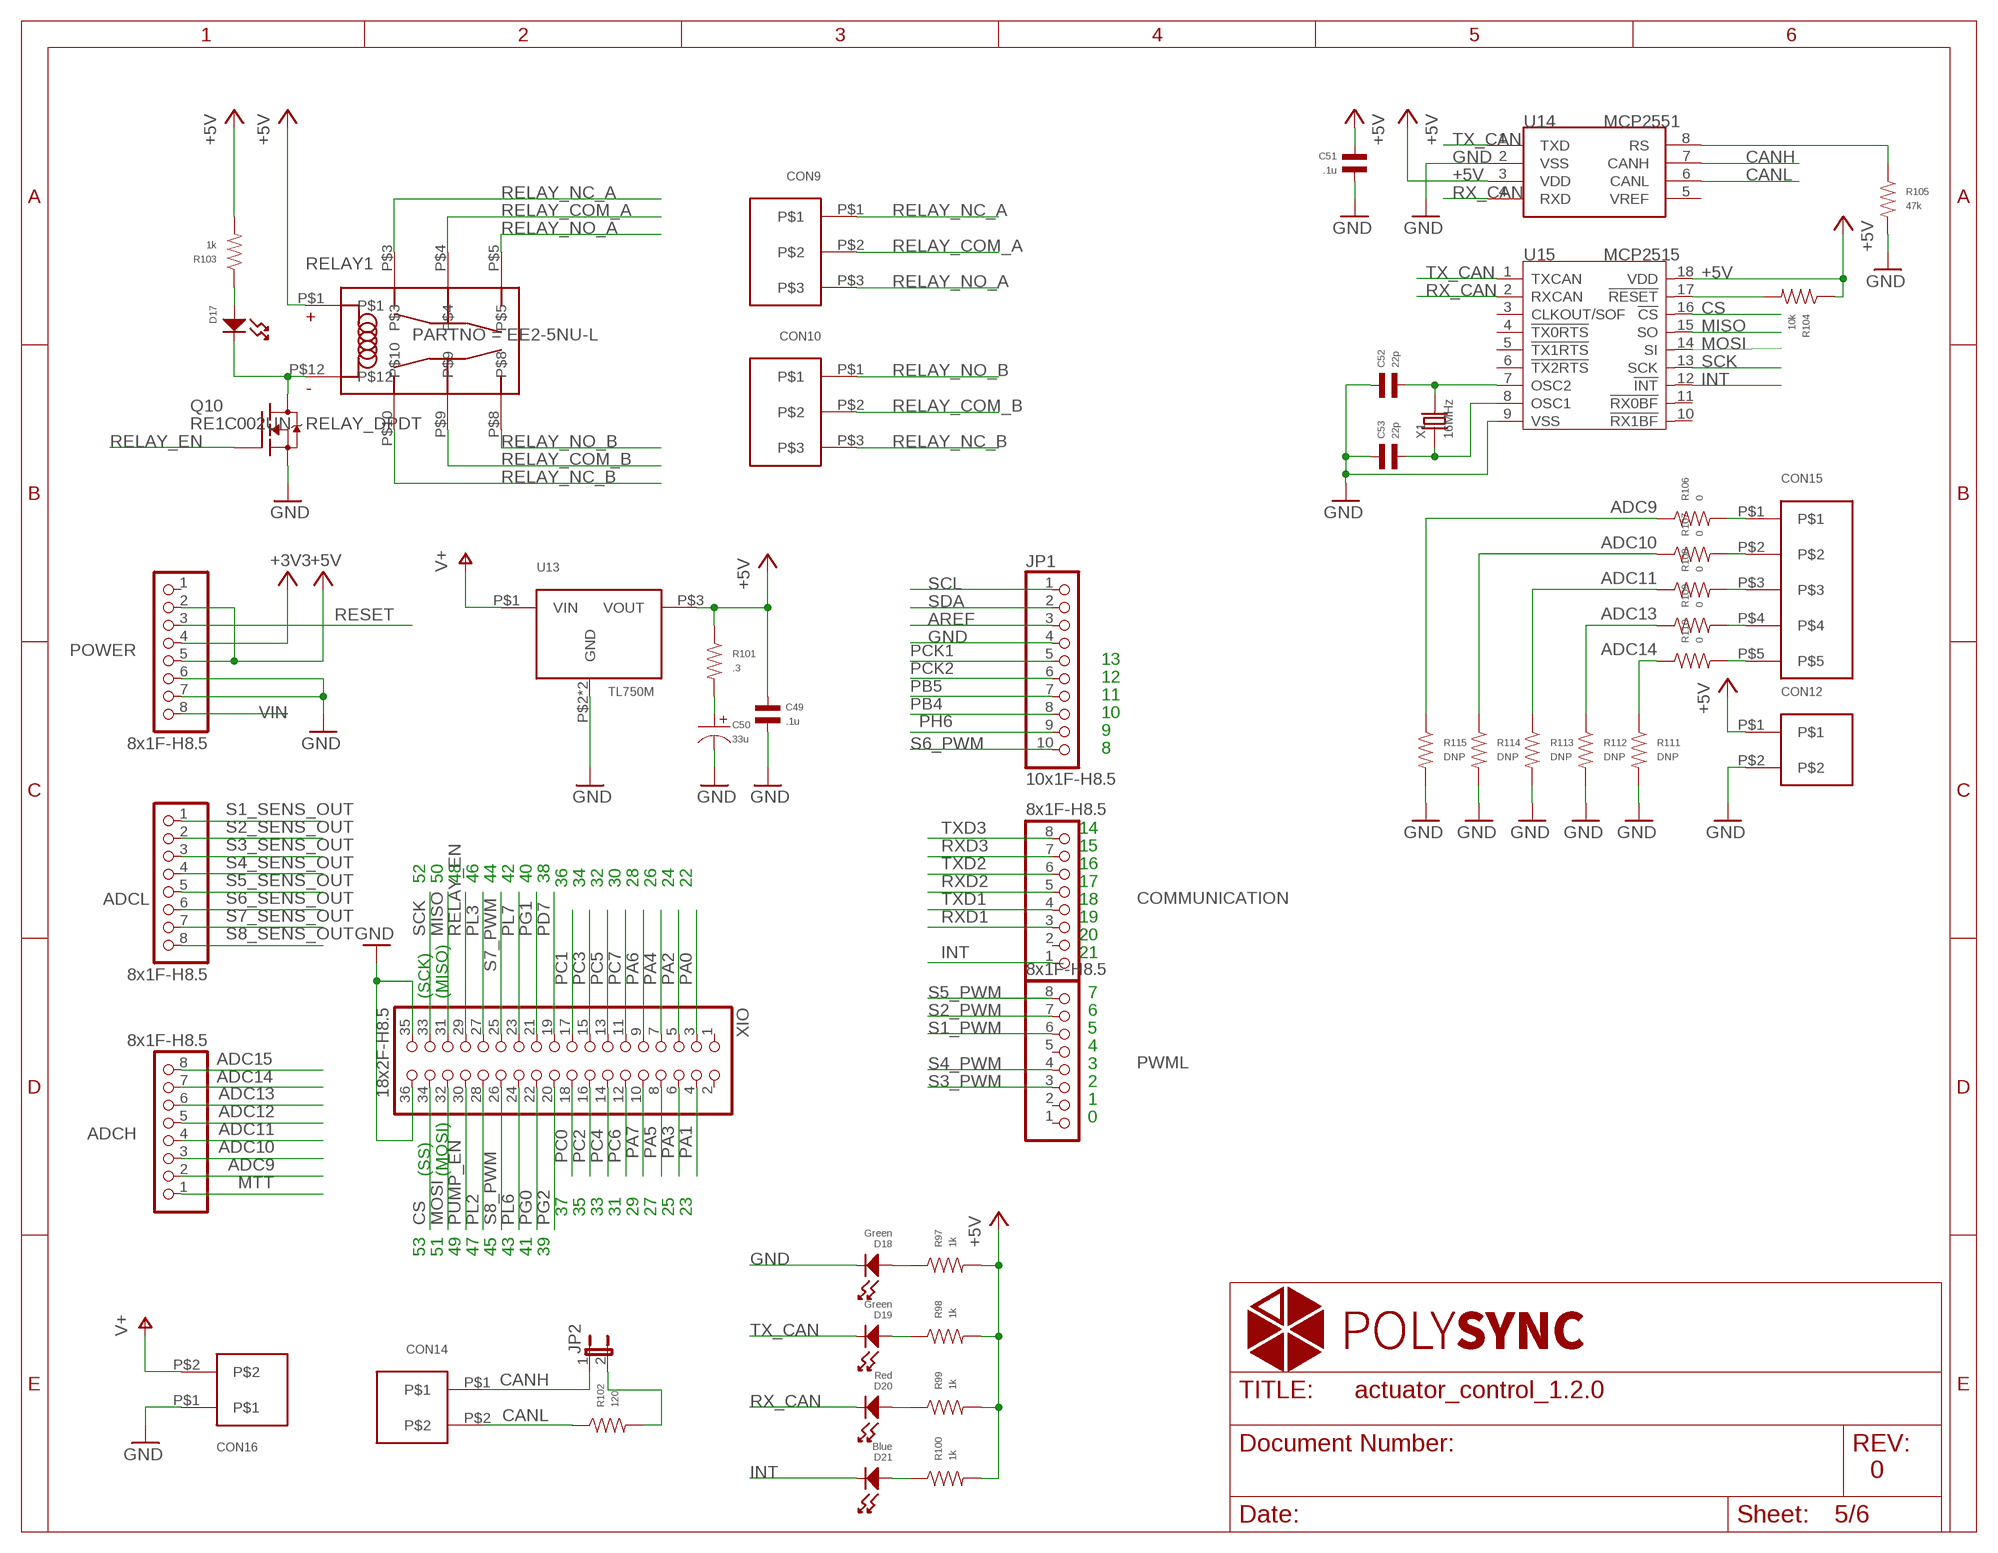
[diagram p4: schematic, sheet 5]

### Parts
ADCH  8x1F-H8.5  PINHD-1X8  [1X08]
ADCL  8x1F-H8.5  PINHD-1X8  [1X08]
C49  .1u  CAPACITOR_NP_0402  [C0402]
C50  33u  CAPACITOR_P  [CP1206]
C51  .1u  CAPACITOR_NP_0402  [C0402]
C52  22p  CAPACITOR_NP_0402  [C0402]
C53  22p  CAPACITOR_NP_0402  [C0402]
COMMUNICATION  8x1F-H8.5  PINHD-1X8  [1X08]
CON9  CON3  [PHOENIX_3_45]
CON10  CON3  [PHOENIX_3_45]
CON12  CON23.5MM  [PHOENIX_2_45]
CON14  CON23.5MM  [PHOENIX_2_45]
CON15  CON5  [PHOENIX_5_45]
CON16  CON23.5MM  [PHOENIX_2_45]
D17  LED_SINGLE-0603  [LED0603]
D18  Green  LED_SINGLE-0603  [LED0603]
D19  Green  LED_SINGLE-0603  [LED0603]
D20  Red  LED_SINGLE-0603  [LED0603]
D21  Blue  LED_SINGLE-0603  [LED0603]
JP1  10x1F-H8.5  PINHD-1X10_ARD  [1X10]
JP2  JP1E  [JP1]
POWER  8x1F-H8.5  PINHD-1X8  [1X08]
PWML  8x1F-H8.5  PINHD-1X8  [1X08]
Q10  RE1C002UN  [EMT3F]
R97  1k  RESISTOR_0402  [R0402]
R98  1k  RESISTOR_0402  [R0402]
R99  1k  RESISTOR_0402  [R0402]
R100  1k  RESISTOR_0402  [R0402]
R101  .3  RESISTOR_0402  [R0402]
R102  120  RESISTOR_0402  [R0402]
R103  1k  RESISTOR_0402  [R0402]
R104  10k  RESISTOR_0402  [R0402]
R105  47k  RESISTOR_0402  [R0402]
R106  0  RESISTOR_0402  [R0402]
R107  0  RESISTOR_0402  [R0402]
R108  0  RESISTOR_0402  [R0402]
R109  0  RESISTOR_0402  [R0402]
R110  0  RESISTOR_0402  [R0402]
R111  DNP  RESISTOR_0402  [R0402]
R112  DNP  RESISTOR_0402  [R0402]
R113  DNP  RESISTOR_0402  [R0402]
R114  DNP  RESISTOR_0402  [R0402]
R115  DNP  RESISTOR_0402  [R0402]
RELAY1  RELAY_DPDT  [KEMET_EE2]
U13  TL750M  [TO-263]
U14  MCP2551  MCP2551-SOIC8  [SOIC8-6.0]
U15  MCP2515  MCP2515-SOIC18  [SOIC18]
X1  16MHz  CRYSTAL-HC49UP  [HC49UP]
XIO  18x2F-H8.5  PINHD-2X18  [2X18]

### Nets
+3V3: POWER.4
+5V: C49.P$1 C51.P$1 CON12.P$1 POWER.2 POWER.5 R97.P$2 R98.P$2 R99.P$2 R100.P$2 R101.P$1 R103.P$2 R104.P$1 RELAY1.P$1 U13.P$3(VOUT) U14.3(VDD) U15.18(VDD) ; also sheet 3,4
ADC9: ADCH.2 R106.P$1 R115.P$1
ADC10: ADCH.3 R107.P$1 R114.P$1
ADC11: ADCH.4 R108.P$1 R113.P$1
ADC12: ADCH.5 ; also sheet 1
ADC13: ADCH.6 R109.P$1 R112.P$1
ADC14: ADCH.7 R110.P$1 R111.P$1
ADC15: ADCH.8
AREF: JP1.3
CANH: CON14.P$1 JP2.1 U14.7(CANH)
CANL: CON14.P$2 R102.P$1 U14.6(CANL)
CS: U15.16(!CS) XIO.34
GND: C49.P$2 C50.P$2 C51.P$2 C52.P$1 C53.P$1 CON12.P$2 CON16.P$1 D18.CATHODE JP1.4 POWER.6 POWER.7 Q10.P$2(S) R105.P$2 R111.P$2 R112.P$2 R113.P$2 R114.P$2 R115.P$2 U13.P$2(GND) U13.P$4(GND) U14.2(VSS) U15.9(VSS) XIO.35 XIO.36 ; also sheet 1,2,3,4,6
INT: COMMUNICATION.1 D21.CATHODE U15.12(!INT)
MISO: U15.15(SO) XIO.31
MOSI: U15.14(SI) XIO.32
MTT: ADCH.1 ; also sheet 6
N$4: CON15.P$1 R106.P$2
N$21: CON15.P$2 R107.P$2
N$22: CON15.P$3 R108.P$2
N$23: C52.P$2 U15.7(OSC2) X1.2
N$24: C53.P$2 U15.8(OSC1) X1.1
N$25: D17.CATHODE Q10.P$3(D) RELAY1.P$12
N$28: D18.ANODE R97.P$1
N$29: D19.ANODE R98.P$1
N$30: D20.ANODE R99.P$1
N$31: D21.ANODE R100.P$1
N$33: R105.P$1 U14.8(RS)
N$34: D17.ANODE R103.P$1
N$35: CON15.P$4 R109.P$2
N$39: CON15.P$5 R110.P$2
N$49: C50.P$1 R101.P$2
N$50: JP2.2 R102.P$2
PA0: XIO.3
PA1: XIO.4
PA2: XIO.5
PA3: XIO.6
PA4: XIO.7
PA5: XIO.8
PA6: XIO.9
PA7: XIO.10
PB4: JP1.8
PB5: JP1.7
PC0: XIO.18
PC1: XIO.17
PC2: XIO.16
PC3: XIO.15
PC4: XIO.14
PC5: XIO.13
PC6: XIO.12
PC7: XIO.11
PCK1: JP1.5 ; also sheet 6
PCK2: JP1.6 ; also sheet 6
PD7: XIO.19
PG0: XIO.22
PG1: XIO.21
PG2: XIO.20
PH6: JP1.9
PL2: XIO.28
PL3: XIO.27
PL6: XIO.24
PL7: XIO.23
PUMP_EN: XIO.30 ; also sheet 6
RELAY_COM_A: CON9.P$2 RELAY1.P$4
RELAY_COM_B: CON10.P$2 RELAY1.P$9
RELAY_EN: Q10.P$1(G) XIO.29
RELAY_NC_A: CON9.P$1 RELAY1.P$3
RELAY_NC_B: CON10.P$3 RELAY1.P$10
RELAY_NO_A: CON9.P$3 RELAY1.P$5
RELAY_NO_B: CON10.P$1 RELAY1.P$8
RESET: POWER.3
RST_N2: R104.P$2 U15.17(!RESET)
RX_CAN: D20.CATHODE U14.4(RXD) U15.2(RXCAN)
RXD1: COMMUNICATION.3
RXD2: COMMUNICATION.5
RXD3: COMMUNICATION.7
S1_PWM: PWML.6 ; also sheet 1
S1_SENS_OUT: ADCL.1 ; also sheet 3
S2_PWM: PWML.7 ; also sheet 1
S2_SENS_OUT: ADCL.2 ; also sheet 3
S3_PWM: PWML.3 ; also sheet 1
S3_SENS_OUT: ADCL.3 ; also sheet 3
S4_PWM: PWML.4 ; also sheet 1
S4_SENS_OUT: ADCL.4 ; also sheet 3
S5_PWM: PWML.8 ; also sheet 2
S5_SENS_OUT: ADCL.5 ; also sheet 4
S6_PWM: JP1.10 ; also sheet 2
S6_SENS_OUT: ADCL.6 ; also sheet 4
S7_PWM: XIO.25 ; also sheet 2
S7_SENS_OUT: ADCL.7 ; also sheet 4
S8_PWM: XIO.26 ; also sheet 2
S8_SENS_OUT: ADCL.8 ; also sheet 4
SCK: U15.13(SCK) XIO.33
SCL: JP1.1
SDA: JP1.2
TX_CAN: D19.CATHODE U14.1(TXD) U15.1(TXCAN)
TXD1: COMMUNICATION.4
TXD2: COMMUNICATION.6
TXD3: COMMUNICATION.8
V+: CON16.P$2 U13.P$1(VIN) ; also sheet 1,6
VIN: POWER.8
Unconnected: COMMUNICATION.2 POWER.1 PWML.1 PWML.2 PWML.5 U14.5(VREF) U15.3(CLKOUT/SOF) U15.4(!TX0RTS) U15.5(!TX1RTS) U15.6(!TX2RTS) U15.10(!RX1BF) U15.11(!RX0BF) XIO.1 XIO.2

### Notes on the sheet
- 13
- 12
- 11
- 10
- 9
- 8
- 14
- 15
- 16
- 52 | 50 | 48 | 46 | 44 | 42 | 40 | 38 | 36 | 34 | 32 | 30 | 28 | 26 | 24 | 22 | 17
- 18
- 19
- 20
- 21
- (SCK) | (MISO) | 7
- 6
- 5
- 4
- 3
- 2
- 1
- 0
- (SS) | (MOSI)
- 37 | 35 | 33 | 31 | 29 | 27 | 25 | 23
- 53 | 51 | 49 | 47 | 45 | 43 | 41 | 39
- 0

## Sheet 6 of 6: Actuator Test
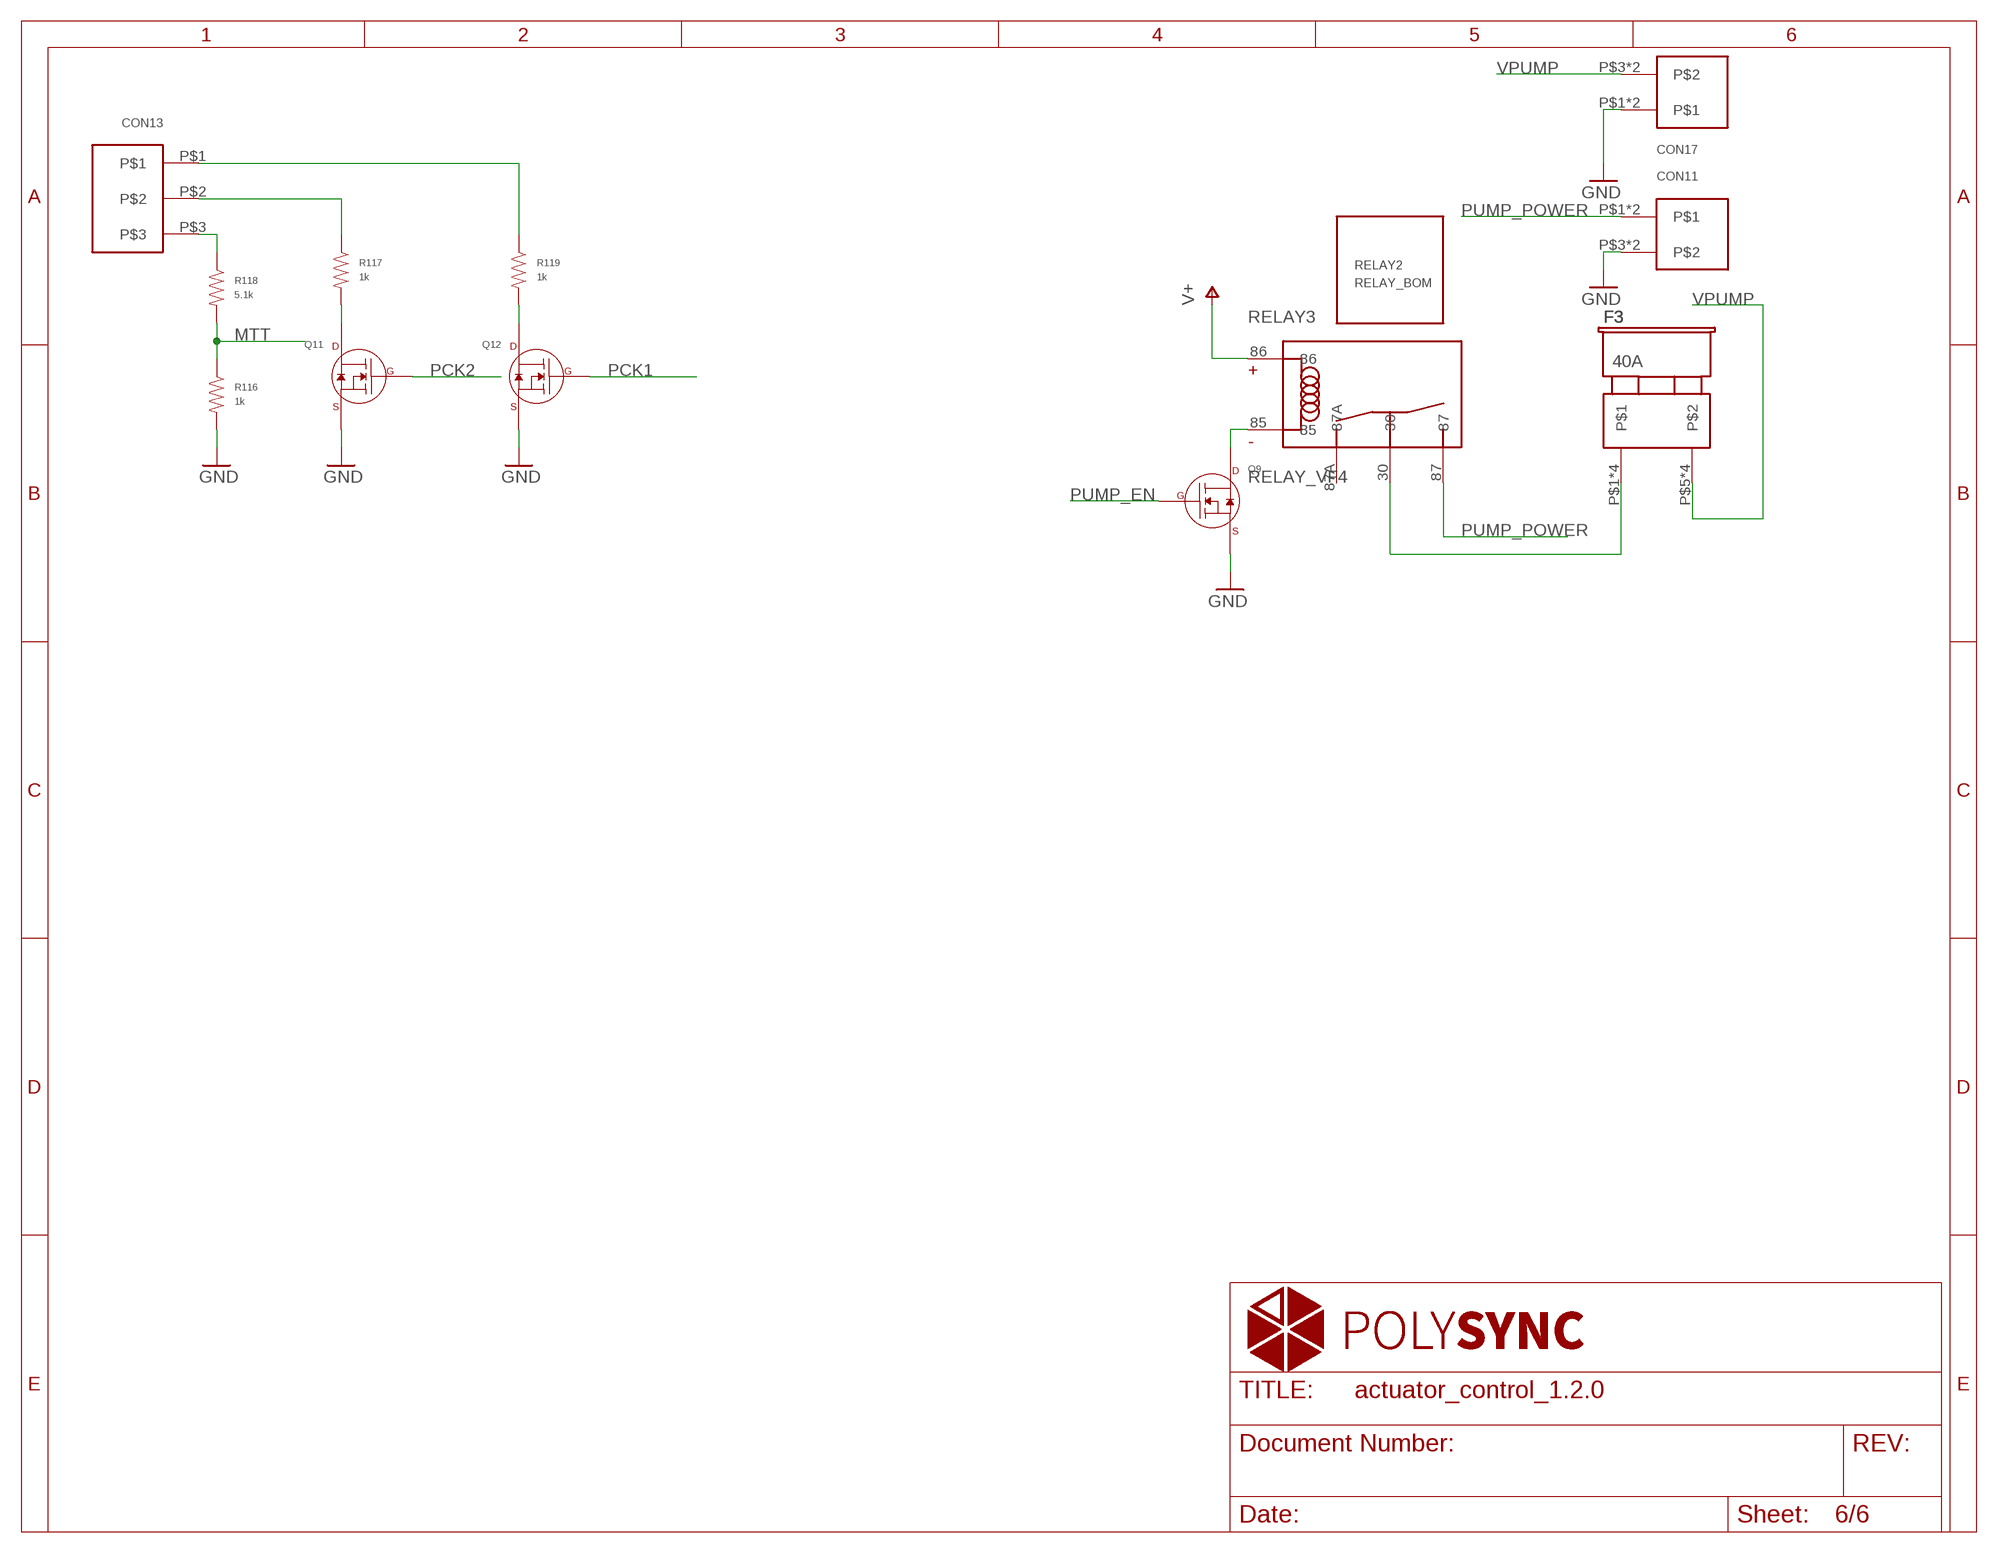
[diagram p5: schematic, sheet 6]

### Parts
CON11  CON210.16MM  [PHOENIX_2_10.16MM]
CON13  CON3  [PHOENIX_3_45]
CON17  CON210.16MM  [PHOENIX_2_10.16MM]
F3  40A  FUSE  [FUSE_ATO]
Q9  N-CHANNEL_FET_SOT-23-3  [SOT-23-3]
Q11  N-CHANNEL_FET_SOT-23-3  [SOT-23-3]
Q12  N-CHANNEL_FET_SOT-23-3  [SOT-23-3]
R116  1k  RESISTOR_0402  [R0402]
R117  1k  RESISTOR_0402  [R0402]
R118  5.1k  RESISTOR_0402  [R0402]
R119  1k  RESISTOR_0402  [R0402]
RELAY2  RELAY_BOM  [VCF4_RELAY]
RELAY3  RELAY_VF4  [VCF4-SOCKET]

### Nets
GND: CON11.P$3 CON11.P$4 CON17.P$1 CON17.P$2 Q9.P$2(SOURCE) Q11.P$2(SOURCE) Q12.P$2(SOURCE) R116.P$2 ; also sheet 1,2,3,4,5
MTT: R116.P$1 R118.P$2 ; also sheet 5
N$51: F3.P$1 F3.P$2 F3.P$3 F3.P$4 RELAY3.30
N$52: Q9.P$3(DRAIN) RELAY3.85
N$123: CON13.P$3 R118.P$1
N$124: CON13.P$2 R117.P$1
N$125: CON13.P$1 R119.P$1
N$126: Q11.P$3(DRAIN) R117.P$2
N$127: Q12.P$3(DRAIN) R119.P$2
PCK1: Q12.P$1(GATE) ; also sheet 5
PCK2: Q11.P$1(GATE) ; also sheet 5
PUMP_EN: Q9.P$1(GATE) ; also sheet 5
PUMP_POWER: CON11.P$1 CON11.P$2 RELAY3.87
V+: RELAY3.86 ; also sheet 1,5
VPUMP: CON17.P$3 CON17.P$4 F3.P$5 F3.P$6 F3.P$7 F3.P$8
Unconnected: RELAY3.87A

## Library data of the parts
ADCH ADCL COMMUNICATION POWER PWML = SmartPrj:PINHD-1X8: PIN HEADER
C1-C49 C51-C53 = MF_Passives:CAPACITOR_NP: Library: MF_Passives Description: Device for Non-Polarized Capacitors. Manufacture part number (MPN) can be added via Attributes. Check https://factory.macrofab.com/parts for the house parts list.; POPULATE: 1
C50 = MF_Passives:CAPACITOR_P: Library: MF_Passives Description: Device for Polarized Capacitors. Manufacture part number (MPN), Voltage Rating, and Tolerance can be added via Attributes. Check https://factory.macrofab.com/parts for the house parts list.
CON1-CON8 CON12 CON14 = polysync:CON2
CON9 CON10 CON13 = polysync:CON3
CON11 CON16 CON17 = polysync:CON2; MFG: PHOENIXCONTACT; PARTNO: 1773976
CON15 = polysync:CON5
D1 D2 D4-D16 = MF_Discrete_Semiconductor:DIODES: Library: MF_Discrete_Semiconductor Description: Device for Single Packaged Diodes.; HOUSEPART: NO; POPULATE: 1
D3 = MF_Discrete_Semiconductor:DIODES: Library: MF_Discrete_Semiconductor Description: Device for Single Packaged Diodes.; HOUSEPART: NO; MFG: Diodes Inc; MPN: US1B-13-F; POPULATE: 1
D17-D21 = MF_LEDs:LED_SINGLE: Library: MF_LEDs Description: Device for Single LED Packages. Manufacture part number (MFG#) can be added via Attributes.; HOUSEPART: NO; POPULATE: 1
F1 F3 = polysync:FUSE; MFG: Littelfuse; PARTNO: 178.6165.0001
JP1 = SmartPrj:PINHD-1X10_ARD: PIN HEADER
JP2 = jumper:JP1E: JUMPER
L1-L8 = MF_Passives:INDUCTOR: Library: MF_Passives Description: Device for Inductors. Manufacture part number (MPN) can be added via Attributes. Check https://factory.macrofab.com/parts for the house parts list.; MFG: Bourns; PARTNO: SRP7050TA-2R2M
Q1-Q8 = polysync:N-FET-TO263
Q9 Q11 Q12 = MF_Discrete_Semiconductor:N-CHANNEL_FET: Library: MF_Discrete_Semiconductor Description: Device for Single N-Channel Mosfet. Manufacture part number (MFG#) can be added via Attributes.; HOUSEPART: NO; POPULATE: 1
Q10 = BTLE_widget:RE1C002UN
R1-R121 = MF_Passives:RESISTOR: Library: MF_Passives Description: Device for Resistors. Manufacture part number (MPN), Voltage, Tolerance, and Wattage Rating can be added via Attributes. Check https://factory.macrofab.com/parts for the house parts list.; POPULATE: 1
RELAY1 = polysync:RELAY_DPDT; PARTNO: EE2-5NU-L
RELAY2 = polysync:RELAY_BOM; MFG: TE; PARTNO: 1432868-1
RELAY3 = polysync:RELAY_VF4; MFG: TE; PARTNO: VCF4-1000
TP1-TP3 = Discrete:PAD-TEST-POINT; PARTNO: DNP
U1-U4 = polysync:UCC27524
U5-U12 = polysync:OPA170
U13 = polysync:TL750M
U14 = IC:MCP2551: High-Speed CAN Transceiver http://ww1.microchip.com/downloads/en/devicedoc/21667f.pdf
U15 = IC:MCP2515: Stand-Alone CAN Controller With SPI Interface
X1 = Discrete:CRYSTAL*: CRYSTAL
XIO = SmartPrj:PINHD-2X18: PIN HEADER

## Net classes
0 default: width 0.152 mm, drill 0.305 mm, clearance 0.152 mm
1 power: width 0.61 mm, drill 0.406 mm, clearance 0.203 mm
2 gnd: width 0.305 mm, drill 0.406 mm, clearance 0.203 mm
3 power usb: width 0.508 mm, drill 0.406 mm, clearance 0.203 mm